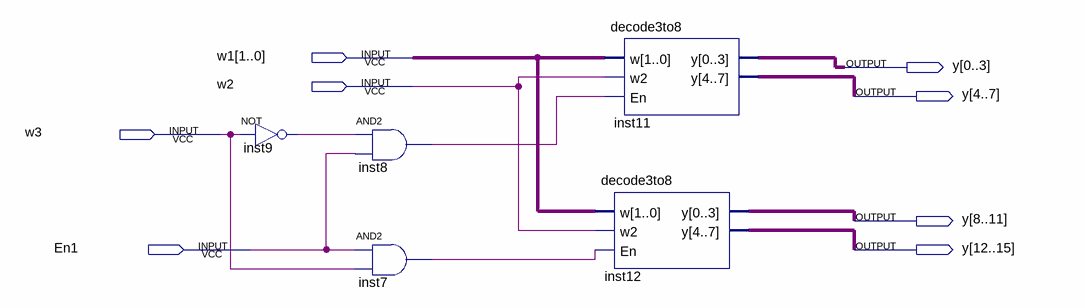
[diagram p0: schematic sheet]
// Quartus schematic decode4to16.bdf as structural Verilog: 5 symbols, 8 pins
module decode4to16 (
  input  [1:0] w1,
  input  w2,
  input  w3,
  input  En1,
  output [0:15] y
);

  wire inst7_out, inst8_out, inst9_out;

  not inst9 (inst9_out, w3);
  and inst8 (inst8_out, inst9_out, En1);
  and inst7 (inst7_out, En1, w3);
  decode3to8 inst11 (.w(w1), .w2(w2), .En(inst8_out), .y({y[7], y[6], y[5], y[4], y[3], y[2], y[1], y[0]}));
  decode3to8 inst12 (.w(w1), .w2(w2), .En(inst7_out), .y({y[15], y[14], y[13], y[12], y[11], y[10], y[9], y[8]}));
endmodule
